# EAGLE design 196EAGLETUTORIAL (EAGLE 8.7.1)
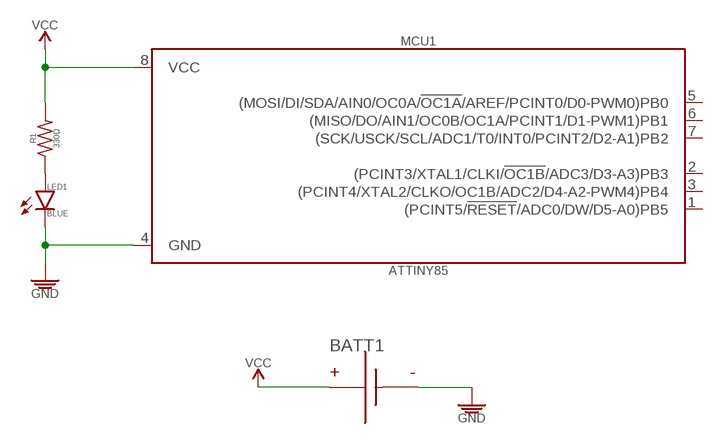
[diagram p0: schematic, sheet 1]

## Parts
BATT1  BATTERYPTH_HOLES  [DUAL_PTH_PADS]
LED1  BLUE  LED_SMD-0805_DISCRETE_BLUE  [LED_SMD-805_]
MCU1  ATTINY85  ATTINY85_DIP-8  [DIP-8]
R1  330Ω  330Ω_PTH-0207/7_1/8W-5%  [RESISTOR-PTH-0207/7]

## Nets
GND: BATT1.-(N) LED1.K MCU1.4(GND)
N$1: LED1.A R1.1
N$2: BATT1.+(P) ; supply symbol labelled VCC
VCC: MCU1.8(VCC) R1.2
Unconnected: MCU1.1((PCINT5/!RESET!/ADC0/DW/D5-A0)PB5) MCU1.2((PCINT3/XTAL1/CLKI/!OC1B!/ADC3/D3-A3)PB3) MCU1.3((PCINT4/XTAL2/CLKO/OC1B/ADC2/D4-A2-PWM4)PB4) MCU1.5((MOSI/DI/SDA/AIN0/OC0A/!OC1A!/AREF/PCINT0/D0-PWM0)PB0) MCU1.6((MISO/DO/AIN1/OC0B/OC1A/PCINT1/D1-PWM1)PB1) MCU1.7((SCK/USCK/SCL/ADC1/T0/INT0/PCINT2/D2-A1)PB2)

## Library data of the parts
BATT1 = PiB_batteries:BATTERY: Generic Dual SMD Pad for Bettery Soldering
LED1 = PiB_leds:LED; CREATOR: MrSwirlyEyes; DATASHEET: http://optoelectronics.liteon.com/upload/download/DS-22-99-0226/LTST-C170TBKT.pdf; DIST: Digikey; DISTLINK: https://www.digikey.com/products/en?keywords=160-1579-1-ND; DISTPN: 160-1579-1-ND; MFR: Lite-On Inc.; MPN: LTST-C170TBKT; TESTED: NO
MCU1 = PiB_ic_microcontrollers:ATTINY85; CREATOR: MrSwirlyEyes; DATASHEET: http://www.atmel.com/Images/Atmel-2586-AVR-8-bit-Microcontroller-ATtiny25-ATtiny45-ATtiny85_Datasheet.pdf; DATASHEET_CONNECTOR: http://www.assmann-wsw.com/fileadmin/datasheets/ASS_0810_CO.pdf; DIST: Digikey; DISTLINK: https://www.digikey.com/products/en?keywords=ATTINY85-20PU-ND; DISTLINK_CONNECTOR: https://www.digikey.com/products/en?keywords=AE9986-ND; DISTPN: ATTINY85-20PU-ND; DISTPN_CONNECTOR: AE9986-ND; DIST_CONNECTOR: Digikey; MFR: Microchip Technology; MFR_CONNECTOR: Assmann WSW Components; MPN: ATTINY85-20PU; MPN_CONNECTOR: A 08-LC-TT; TESTED: NO
R1 = PiB_resistors:330Ω; CREATOR: MrSwirlyEyes; TESTED: NO

## Board
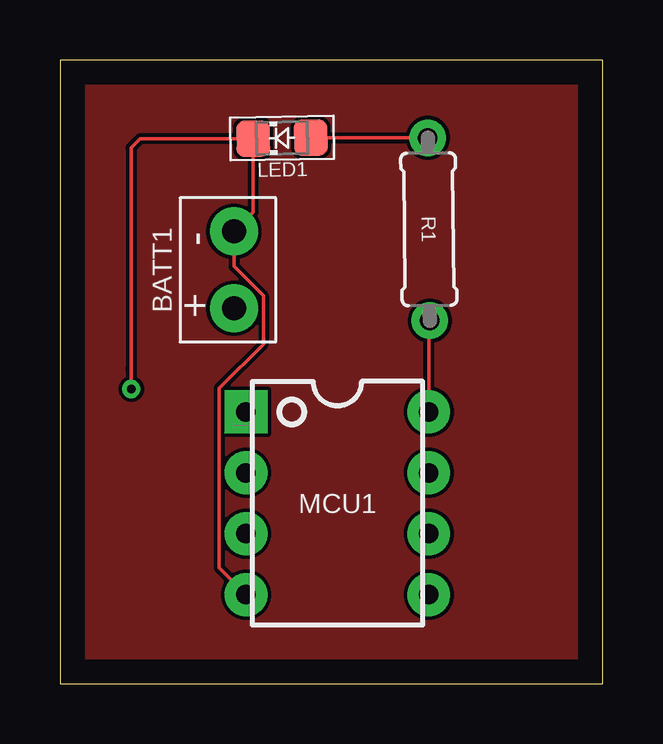
[diagram p1: board, top side]
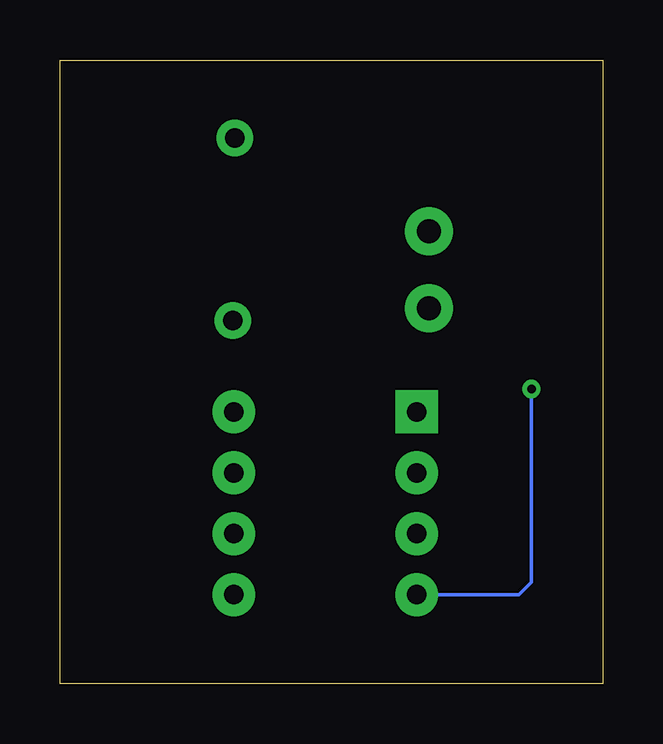
[diagram p2: board, bottom side, seen from below]

Size 22.63 x 25.99 mm. Coordinates in mm from the lower left corner, seen from the top.
Outline: 0,0 22.63,0 22.63,25.99 0,25.99 0,0
Copper layers (1*16): Top 0.035mm / dielectric 1.5mm / Bottom 0.035mm
Design rules "default": minimum track width 6mil, minimum drill 0.35mm, track to track 6mil, track to pad 6mil, pad to pad 6mil, via to via 6mil, smd to smd 6mil, copper to edge 40mil, drill to drill 6mil, minimum pad ring 10mil, minimum via ring 8mil, stop-mask expansion 4mil, vias tented up to drill 0mil, thermal gap 10mil

### Footprints (pad centres in the part's own frame; a part is rotated, then mirrored left to right if it is on the bottom)
DUAL_PTH_PADS = drill 1 pad 2: + -1.6,0; - 1.6,0
LED_SMD-805_ = smd 1.4 x 1.5: A -1.2,0; K 1.2,0
DIP-8 = drill 0.813 pad 1.778 square: 1 -3.81,3.81 | drill 0.813 pad 1.778: 2 -3.81,1.27; 3 -3.81,-1.27; 4 -3.81,-3.81; 5 3.81,-3.81; 6 3.81,-1.27; 7 3.81,1.27; 8 3.81,3.81
RESISTOR-PTH-0207/7 = drill 0.813 pad 1.524: 1 -3.81,0; 2 3.81,0

### Placement (x,y rotation side)
BATT1  7.25,17.25 90 top
LED1  9.26,22.73 181 top
MCU1  11.57,7.52 0 top
R1  15.38,18.94 270.6 top

### Tracks (layer width: path | path; a pad name or v marks a point on that pad's centre or on a via)
GND  (via drill 0.35)
  Top 0.152: MCU1.4 6.64,4.83 6.64,12.31 8.48,14.15 8.48,16.16 7.25,17.38 BATT1.- 8.06,19.65 LED1.K 3.35,22.71 2.96,22.33 2.96,13.13 2.96,13.08 2.96,12.29 v2.97,12.28
  Bottom 0.152: v2.97,12.28 2.97,4.23 3.49,3.71 MCU1.4
N$1
  Top 0.152: LED1.A R1.1
N$3
  pour Top: 0.04,0.03 22.63,0.03 22.67,-0.01 22.67,25.98 -0.03,25.98 0,25.96
VCC
  Top 0.152: MCU1.8 15.38,15.09 R1.2